# Altium schematic sheet MotorControllerBoard.SchDoc
size A4
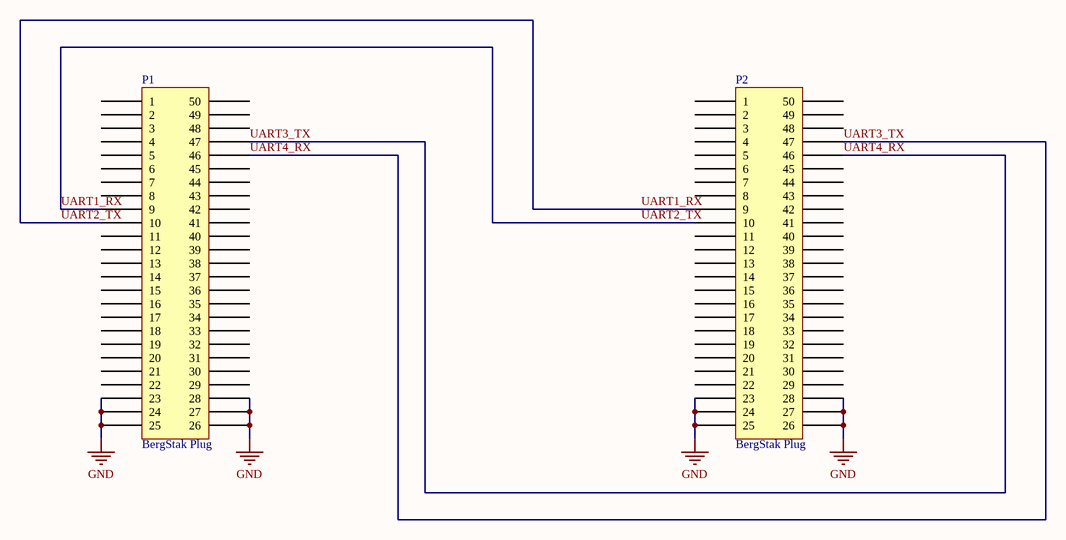
[diagram p0: MotorControllerBoard.SchDoc]

## Parts
P1  BergStak Plug  [609-5226-1-ND]
P2  BergStak Plug  [609-5226-1-ND]

## Nets
GND: P1.23 P1.24 P1.25 P1.26 P1.27 P1.28 P2.23 P2.24 P2.25 P2.26 P2.27 P2.28
UART1_RX: P1.9 P1.10 P2.9 P2.10  [also labelled UART2_TX]
UART3_TX: P1.46 P1.47 P2.46 P2.47  [also labelled UART4_RX]

Not connected (* = marked no-connect by the designer): P1 1 2 3 4 5 6 7 8 11 12 13 14 15 16 17 18 19 20 21 22 29 30 31 32 33 34 35 36 37 38 39 40 41 42 43 44 45 48 49 50; P2 1 2 3 4 5 6 7 8 11 12 13 14 15 16 17 18 19 20 21 22 29 30 31 32 33 34 35 36 37 38 39 40 41 42 43 44 45 48 49 50

## Library data of the parts
P1 P2 = BergStak 50 Position Connector Plug: 50 Position Connector Plug, Outer Shroud Contacts Surface Mount Gold; Manufacturer PN: 10132797-055100LF; Digikey PN: 609-5226-1-ND